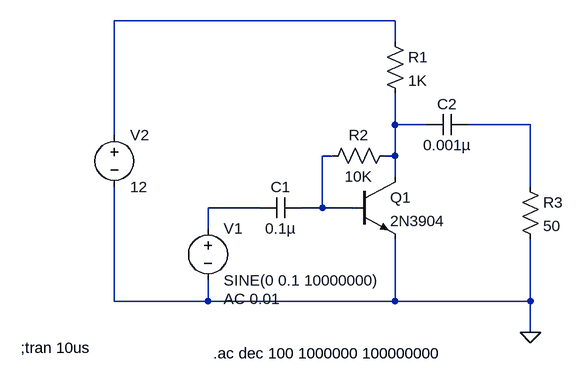
[diagram p0: schematic OutAmp.asc]
OutAmp.asc, the LTspice schematic file:
Version 4
SHEET 1 880 680
WIRE 240 -128 -192 -128
WIRE 240 -96 240 -128
WIRE 240 32 240 -16
WIRE 288 32 240 32
WIRE 448 32 352 32
WIRE -192 48 -192 -128
WIRE 144 80 128 80
WIRE 240 80 240 32
WIRE 240 80 224 80
WIRE 240 112 240 80
WIRE 448 128 448 32
WIRE 32 160 -48 160
WIRE 128 160 128 80
WIRE 128 160 96 160
WIRE 176 160 128 160
WIRE -48 192 -48 160
WIRE -192 304 -192 128
WIRE -48 304 -48 272
WIRE -48 304 -192 304
WIRE 240 304 240 208
WIRE 240 304 -48 304
WIRE 448 304 448 208
WIRE 448 304 240 304
WIRE 448 352 448 304
FLAG 448 352 0
SYMBOL npn 176 112 R0
SYMATTR InstName Q1
SYMATTR Value 2N3904
SYMBOL cap 96 144 R90
WINDOW 0 0 32 VBottom 2
WINDOW 3 32 32 VTop 2
SYMATTR InstName C1
SYMATTR Value 0.1µ
SYMBOL res 224 -112 R0
SYMATTR InstName R1
SYMATTR Value 1K
SYMBOL res 240 64 R90
WINDOW 0 0 56 VBottom 2
WINDOW 3 32 56 VTop 2
SYMATTR InstName R2
SYMATTR Value 10K
SYMBOL voltage -48 176 R0
WINDOW 123 24 124 Left 2
WINDOW 39 0 0 Left 0
SYMATTR Value2 AC 0.01
SYMATTR InstName V1
SYMATTR Value SINE(0 0.1 10000000)
SYMBOL voltage -192 32 R0
SYMATTR InstName V2
SYMATTR Value 12
SYMBOL cap 352 16 R90
WINDOW 0 0 32 VBottom 2
WINDOW 3 32 32 VTop 2
SYMATTR InstName C2
SYMATTR Value 0.001µ
SYMBOL res 432 112 R0
SYMATTR InstName R3
SYMATTR Value 50
TEXT -336 376 Left 2 !;tran 10us
TEXT -40 384 Left 2 !.ac dec 100 1000000 100000000

The netlist it stands for:
* OutAmp.asc
Q1 N002 N004 0 0 2N3904
C1 N004 N005 0.1µ
R1 N001 N002 1K
R2 N002 N004 10K
V1 N005 0 SINE(0 0.1 10000000) AC 0.01
V2 N001 0 12
C2 N003 N002 0.001µ
R3 N003 0 50
.model NPN NPN
.model PNP PNP
.lib standard.bjt
;tran 10us
.ac dec 100 1000000 100000000
.backanno
.end